# EAGLE design eggbotD1 (EAGLE 7.7.0)
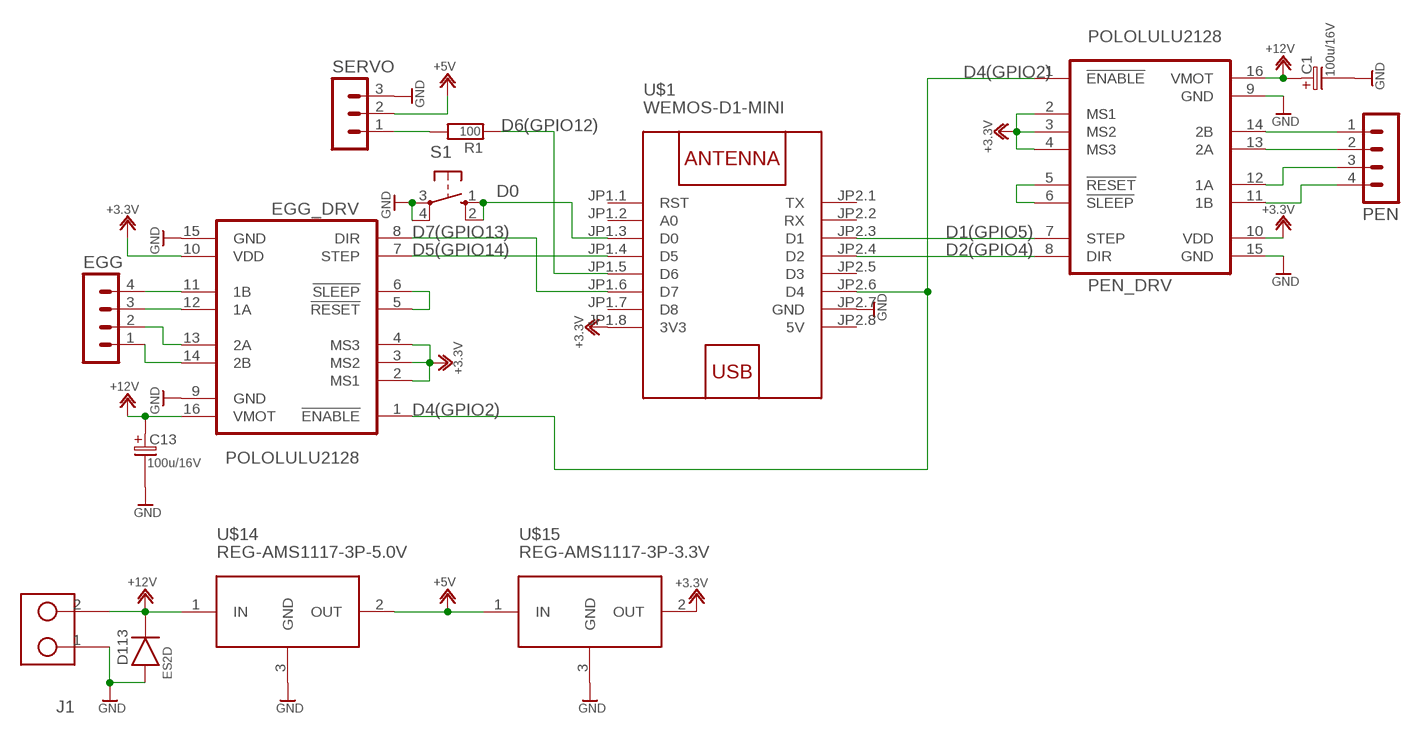
[diagram p0: schematic, sheet 1]

## Parts
C1  100u/16V  C-EL-3,5/8  [ES-3,5/8]
C13  100u/16V  C-EL-3,5/8  [ES-3,5/8]
D113  ES2D  DIODESMB  [SMB]
EGG  MA04-1  [MA04-1]
EGG_DRV  POLOLULU2128  [POLOLULU2128]
J1  GMKDS-2  [GMKDS1,5]
PEN  MA04-1  [MA04-1]
PEN_DRV  POLOLULU2128  [POLOLULU2128]
R1  100  RES-0805  [0805]
S1  10-XX  [B3F-10XX]
SERVO  MA03-1  [MA03-1]
U$1  WEMOS-D1-MINI  [WEMOS-D1-MINI]
U$14  REG-AMS1117-3P-5.0V  [REG-AMS1117-3P]
U$15  REG-AMS1117-3P-3.3V  [REG-AMS1117-3P]

## Nets
+3.3V: EGG_DRV.2(MS1) EGG_DRV.3(MS2) EGG_DRV.4(MS3) EGG_DRV.10(VDD) PEN_DRV.2(MS1) PEN_DRV.3(MS2) PEN_DRV.4(MS3) PEN_DRV.10(VDD) U$1.JP1.8(3V3) U$15.2(OUT)
+5V: SERVO.2 U$14.2(OUT) U$15.1(IN)
+12V: C1.1 C13.1 D113.2(K) EGG_DRV.16(VMOT) J1.2 PEN_DRV.16(VMOT) U$14.1(IN)
D0: S1.1(S) S1.2(S1) U$1.JP1.3(D0)
D1(GPIO5): PEN_DRV.7(STEP) U$1.JP2.3(D1)
D2(GPIO4): PEN_DRV.8(DIR) U$1.JP2.4(D2)
D4(GPIO2): EGG_DRV.1(!ENABLE) PEN_DRV.1(!ENABLE) U$1.JP2.6(D4)
D5(GPIO14): EGG_DRV.7(STEP) U$1.JP1.4(D5)
D6(GPIO12): R1.1 U$1.JP1.5(D6)
D7(GPIO13): EGG_DRV.8(DIR) U$1.JP1.6(D7)
GND: C1.2 C13.2 D113.1(A) EGG_DRV.9(GND) EGG_DRV.15(GND) J1.1 PEN_DRV.9(GND) PEN_DRV.15(GND) S1.3(P) S1.4(P1) SERVO.3 U$1.JP2.7(GND) U$14.3(GND) U$15.3(GND)
N$1: EGG_DRV.5(!RESET) EGG_DRV.6(!SLEEP)
N$2: PEN_DRV.5(!RESET) PEN_DRV.6(!SLEEP)
N$3: R1.2 SERVO.1
N$4: PEN.1 PEN_DRV.14(2B)
N$5: PEN.2 PEN_DRV.13(2A)
N$6: PEN.3 PEN_DRV.12(1A)
N$7: PEN.4 PEN_DRV.11(1B)
N$8: EGG.4 EGG_DRV.11(1B)
N$9: EGG.3 EGG_DRV.12(1A)
N$10: EGG.2 EGG_DRV.13(2A)
N$11: EGG.1 EGG_DRV.14(2B)
Unconnected: U$1.JP1.1(RST) U$1.JP1.2(A0) U$1.JP1.7(D8) U$1.JP2.1(TX) U$1.JP2.2(RX) U$1.JP2.5(D3)

## Power pins joined to a net without a drawn wire
5V: U$1.JP2.8(5V)

## Library data of the parts
C1 C13 = DISCRETE_mm:C-EL: Kondesator elektrolityczny przewlekany
D113 = SMD_mm:DIODE: Dioda
EGG PEN = con-lstb:MA04-1: PIN HEADER; OC_FARNELL: unknown; OC_NEWARK: unknown
EGG_DRV PEN_DRV = stepper_drivers_etc:POLOLULU2128
J1 = ELFIN:GMKDS-2
R1 = SMD:RES-0805
S1 = switch-omron:10-XX: OMRON SWITCH; MPN: B3F-1000; OC_FARNELL: 176432; OC_NEWARK: 36M3542
SERVO = con-lstb:MA03-1: PIN HEADER
U$1 = diy-modules:WEMOS-D1-MINI: WEMOS D1 mini: Mini Wi-Fi Board based on ESP-8266 device More details can be found here: https://www.wemos.cc/product/d1-mini.html Click here to find device on ebay.com <http://www.ebay.com/sch/wemos+d1+mini+nodemcu>
U$14 U$15 = diy-modules:REG-AMS1117-3P-*: Linear Regulator based on AMS1117 chip 3-pin version AMS1117 datasheet is available here: http://www.advanced-monolithic.com/pdf/ds1117.pdf Click here to find device on ebay.com <http://www.ebay.com/sch/ams1117+module> Note: There are many variants. Search for the proper version.

## Net classes
0 default: width 0.2 mm, drill 0.25 mm, clearance 0.15 mm

## Board
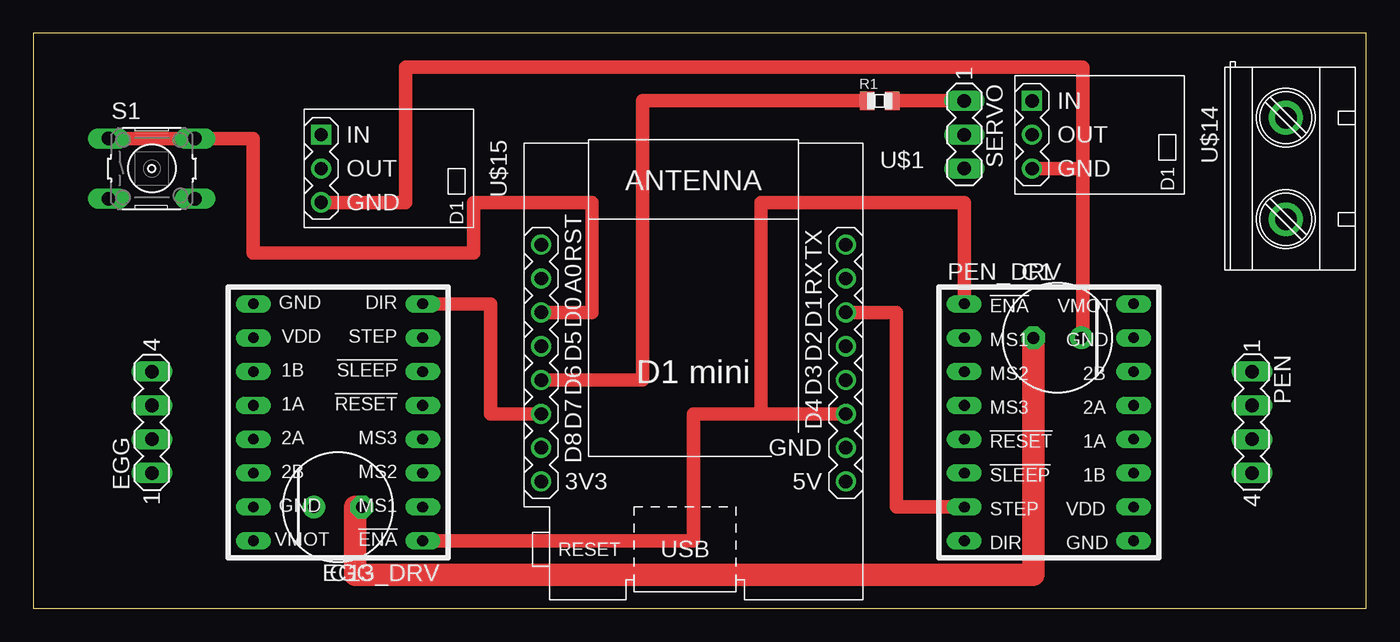
[diagram p1: board, top side]
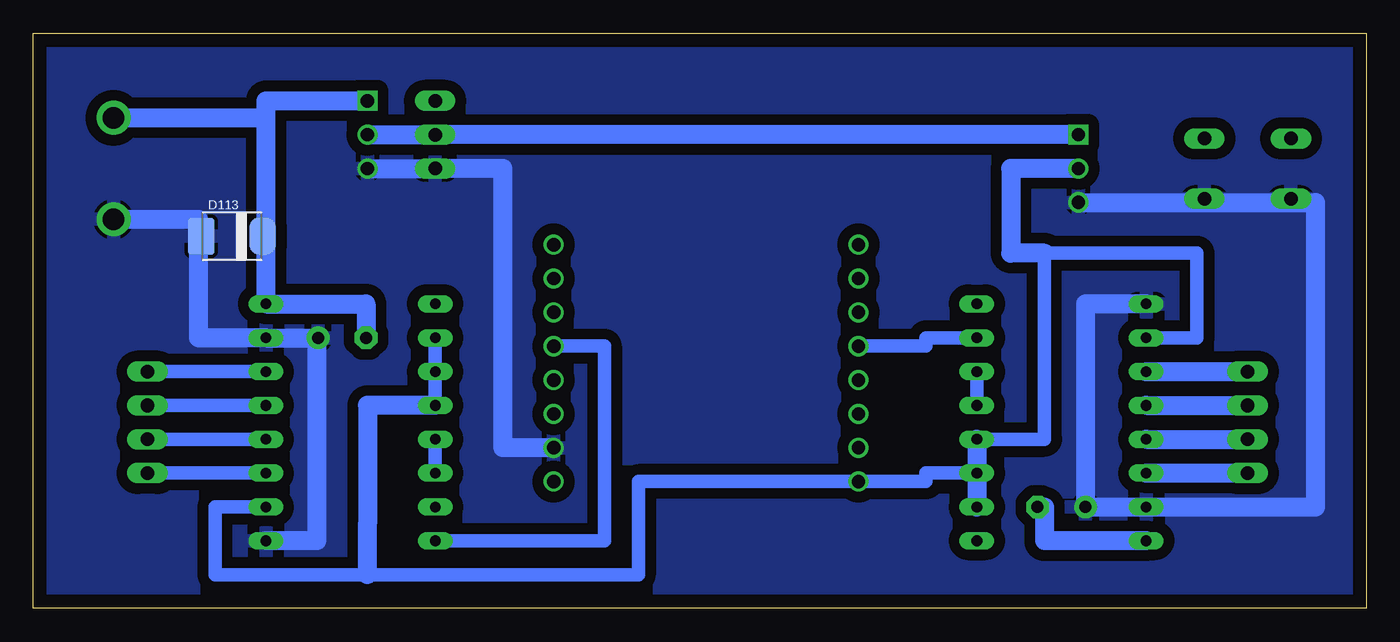
[diagram p2: board, bottom side, seen from below]

Size 100 x 43.17 mm. Coordinates in mm from the lower left corner, seen from the top.
Outline: 0,0 100,0 100,43.17 0,43.17 0,0
Copper layers (1*16): Top 0.035mm / dielectric 1.5mm / Bottom 0.035mm
Design rules "default": minimum track width 10mil, minimum drill 24mil, track to track 8mil, track to pad 8mil, pad to pad 8mil, via to via 8mil, smd to smd 8mil, copper to edge 40mil, drill to drill 8mil, minimum pad ring 10mil, minimum via ring 8mil, stop-mask expansion 4mil, vias tented up to drill 0mil, thermal gap 10mil

### Footprints (pad centres in the part's own frame; a part is rotated, then mirrored left to right if it is on the bottom)
ES-3,5/8 = drill 0.9 pad 1.7 octagon: 1 -1.8,0 | drill 0.9 pad 1.7: 2 1.8,0
SMB = smd 2 x 2.8: 1 -2.3,0; 2 2.3,0
MA04-1 = drill 1.016 long: 1 -3.81,0; 2 -1.27,0; 3 1.27,0; 4 3.81,0
POLOLULU2128 = drill 0.8 long: 1 -7.62,7.62; 2 -7.62,5.08; 3 -7.62,2.54; 4 -7.62,0; 5 -7.62,-2.54; 6 -7.62,-5.08; 7 -7.62,-7.62; 8 -7.62,-10.16; 9 5.08,-10.16; 10 5.08,-7.62; 11 5.08,-5.08; 12 5.08,-2.54; 13 5.08,0; 14 5.08,2.54; 15 5.08,5.08; 16 5.08,7.62
GMKDS1,5 = drill 1.6 pad 2.54: 1 0,3.81; 2 0,-3.81
0805 = smd 1.092 x 1.397: 1 -0.94,0; 2 0.94,0
B3F-10XX = drill 1.016 long: 1 -3.251,2.261; 2 3.251,2.261; 3 -3.251,-2.261; 4 3.251,-2.261
MA03-1 = drill 1.016 long: 1 -2.54,0; 2 0,0; 3 2.54,0
WEMOS-D1-MINI = drill 1: JP1.1 -11.43,9.525; JP1.2 -11.43,6.985; JP1.3 -11.43,4.445; JP1.4 -11.43,1.905; JP1.5 -11.43,-0.635; JP1.6 -11.43,-3.175; JP1.7 -11.43,-5.715; JP1.8 -11.43,-8.255; JP2.1 11.43,9.525; JP2.2 11.43,6.985; JP2.3 11.43,4.445; JP2.4 11.43,1.905; JP2.5 11.43,-0.635; JP2.6 11.43,-3.175; JP2.7 11.43,-5.715; JP2.8 11.43,-8.255
REG-AMS1117-3P = drill 1 square: 1 -2.54,-5.08 | drill 1: 2 0,-5.08; 3 2.54,-5.08

### Placement (x,y rotation side)
C1  76.83,20.32 0 top
C13  22.86,7.62 180 top
D113  85.09,27.94 0 bottom
EGG  8.89,13.97 90 top
EGG_DRV  21.59,12.7 180 top
J1  93.98,33.02 180 top
PEN  91.44,13.97 270 top
PEN_DRV  77.47,15.24 0 top
R1  63.5,38.1 0 top
S1  8.89,33.02 0 top
SERVO  69.85,35.56 270 top
U$1  49.53,17.78 0 top
U$14  80.01,35.56 270 top
U$15  26.67,33.02 270 top

### Tracks (layer width: path | path; a pad name or v marks a point on that pad's centre or on a via)
+3.3V
  Bottom 1.016: PEN_DRV.4 PEN_DRV.3 PEN_DRV.2 | PEN_DRV.10 86.36,7.62 86.36,2.54 74.93,2.54 54.61,2.54 54.61,9.53 U$1.JP1.8 33.02,9.53 33.02,10.16 EGG_DRV.3 | EGG_DRV.4 24.13,12.7 24.13,26.67 12.7,26.67 12.7,20.32 EGG_DRV.10
  Bottom 1.422: PEN_DRV.4 74.93,15.24 74.93,6.35 74.93,2.54 | EGG_DRV.4 EGG_DRV.3 EGG_DRV.2 | U$15.2 26.67,33.02 26.67,26.67 24.13,26.67
+5V
  Bottom 1.422: U$14.2 SERVO.2 U$15.1
+12V
  Top 1.676: C13.1 24.13,7.62 24.13,2.54 75.03,2.54 C1.1
  Bottom 1.016: D113.2 82.55,27.94
  Bottom 1.422: 82.55,38.1 U$14.1 | 82.55,38.1 82.55,27.94 PEN_DRV.16 75.03,22.86 C1.1 | EGG_DRV.16 24.13,5.08 24.13,7.62 C13.1 | J1.2 82.55,36.83 82.55,38.1
D0
  Top 1.016: U$1.JP1.3 41.91,22.23 41.91,25.4 41.91,30.48 33.02,30.48 33.02,26.67 16.51,26.67 16.51,34.29 16.51,35.28 S1.2 S1.1
D1(GPIO5)
  Top 1.016: U$1.JP2.3 64.77,22.23 64.77,7.62 PEN_DRV.7
D2(GPIO4)
  Bottom 1.016: U$1.JP2.4 57.15,19.68 57.15,19.05 57.15,5.08 PEN_DRV.8
D4(GPIO2)
  Top 1.016: EGG_DRV.1 49.53,5.08 49.53,13.97 49.53,14.61 54.61,14.61 | U$1.JP2.6 54.61,14.61 | PEN_DRV.1 69.85,26.67 69.85,30.48 54.61,30.48 54.61,14.61
D5(GPIO14)
  Bottom 1.016: EGG_DRV.7 33.02,20.32 33.02,19.68 U$1.JP1.4
D6(GPIO12)
  Top 1.016: U$1.JP1.5 45.72,17.14 45.72,38.1 55.88,38.1 R1.1
D7(GPIO13)
  Top 1.016: EGG_DRV.8 34.29,22.86 34.29,15.24 34.29,14.61 U$1.JP1.6
GND
  Top 1.016: C1.2 78.74,20.32 78.74,33.02 | 78.74,33.02 78.74,40.64 27.94,40.64 27.94,30.48 U$15.3 | U$14.3 78.74,33.02
  Bottom 1.016: S1.3 5.08,30.76 5.08,30.48 | S1.4 12.7,30.76 12.7,30.48 | D113.1 87.63,27.94
  Bottom 1.422: J1.1 87.63,29.21 87.63,27.94 87.63,20.32 PEN_DRV.15 C1.2 78.74,20.32 78.74,5.08 PEN_DRV.9 | EGG_DRV.9 21.06,22.86 C13.2 EGG_DRV.15 3.81,7.62 3.81,30.48 5.08,30.48 12.7,30.48 U$15.3 | U$14.3 SERVO.3 64.77,33.02 64.77,12.06 U$1.JP2.7
  pour Bottom (isolate 0.813): 1.27,41.91 99.06,41.91 99.06,1.27 1.27,1.27
N$1
  Bottom 1.016: EGG_DRV.5 29.21,16.51 EGG_DRV.6
N$2
  Bottom 1.016: PEN_DRV.6 PEN_DRV.5
N$3
  Top 1.016: SERVO.1 67.31,38.1 R1.2
N$4
  Bottom 1.016: PEN_DRV.14 PEN.1
N$5
  Bottom 1.016: PEN_DRV.13 PEN.2
N$6
  Bottom 1.016: PEN_DRV.12 PEN.3
N$7
  Bottom 1.016: PEN_DRV.11 PEN.4
N$8
  Bottom 1.422: EGG_DRV.11 EGG.4
N$9
  Bottom 1.422: EGG_DRV.12 EGG.3
N$10
  Bottom 1.422: EGG_DRV.13 EGG.2
N$11
  Bottom 1.422: EGG_DRV.14 EGG.1